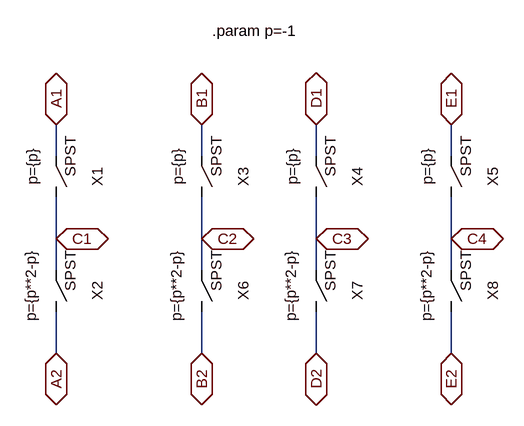
[diagram p0: schematic 4PDT_OnOn.asc]
4PDT_OnOn.asc, the LTspice schematic file:
Version 4
SHEET 1 880 680
WIRE -80 144 -80 96
WIRE 144 144 144 96
WIRE 320 144 320 96
WIRE 528 144 528 96
WIRE -80 272 -80 208
WIRE 144 272 144 208
WIRE 320 272 320 208
WIRE 528 272 528 208
WIRE -80 320 -80 272
WIRE 144 320 144 272
WIRE 320 320 320 272
WIRE 528 320 528 272
WIRE -80 448 -80 384
WIRE 144 448 144 384
WIRE 320 448 320 384
WIRE 528 448 528 384
FLAG 144 96 B1
IOPIN 144 96 BiDir
FLAG 320 96 D1
IOPIN 320 96 BiDir
FLAG 144 272 C2
IOPIN 144 272 BiDir
FLAG 320 272 C3
IOPIN 320 272 BiDir
FLAG 144 448 B2
IOPIN 144 448 BiDir
FLAG 320 448 D2
IOPIN 320 448 BiDir
FLAG 528 96 E1
IOPIN 528 96 BiDir
FLAG 528 272 C4
IOPIN 528 272 BiDir
FLAG 528 448 E2
IOPIN 528 448 BiDir
FLAG -80 96 A1
IOPIN -80 96 BiDir
FLAG -80 272 C1
IOPIN -80 272 BiDir
FLAG -80 448 A2
IOPIN -80 448 BiDir
SYMBOL SPST -80 176 R90
WINDOW 39 -16 37 Center 2
SYMATTR InstName X1
SYMATTR SpiceLine p={p}
SYMBOL SPST -80 352 R90
WINDOW 39 -9 39 Center 2
SYMATTR InstName X2
SYMATTR SpiceLine p={p**2-p}
SYMBOL SPST 144 176 R90
WINDOW 39 -16 37 Center 2
SYMATTR InstName X3
SYMATTR SpiceLine p={p}
SYMBOL SPST 320 176 R90
WINDOW 39 -16 37 Center 2
SYMATTR InstName X4
SYMATTR SpiceLine p={p}
SYMBOL SPST 528 176 R90
WINDOW 39 -16 37 Center 2
SYMATTR InstName X5
SYMATTR SpiceLine p={p}
SYMBOL SPST 144 352 R90
WINDOW 39 -9 39 Center 2
SYMATTR InstName X6
SYMATTR SpiceLine p={p**2-p}
SYMBOL SPST 320 352 R90
WINDOW 39 -9 39 Center 2
SYMATTR InstName X7
SYMATTR SpiceLine p={p**2-p}
SYMBOL SPST 528 352 R90
WINDOW 39 -9 39 Center 2
SYMATTR InstName X8
SYMATTR SpiceLine p={p**2-p}
TEXT 160 -48 Left 2 !.param p=-1

The netlist it stands for:
* 4PDT_OnOn.asc
XX1 A1 C1 SPST p={p}  ; pins In Out
XX2 C1 A2 SPST p={p**2-p}  ; pins In Out
XX3 B1 C2 SPST p={p}  ; pins In Out
XX4 D1 C3 SPST p={p}  ; pins In Out
XX5 E1 C4 SPST p={p}  ; pins In Out
XX6 C2 B2 SPST p={p**2-p}  ; pins In Out
XX7 C3 D2 SPST p={p**2-p}  ; pins In Out
XX8 C4 E2 SPST p={p**2-p}  ; pins In Out
.param p=-1
.backanno
.end